# Altium schematic sheet DEBUG.SchDoc
size A3; SheetNumber: 15; SheetTotal: 24
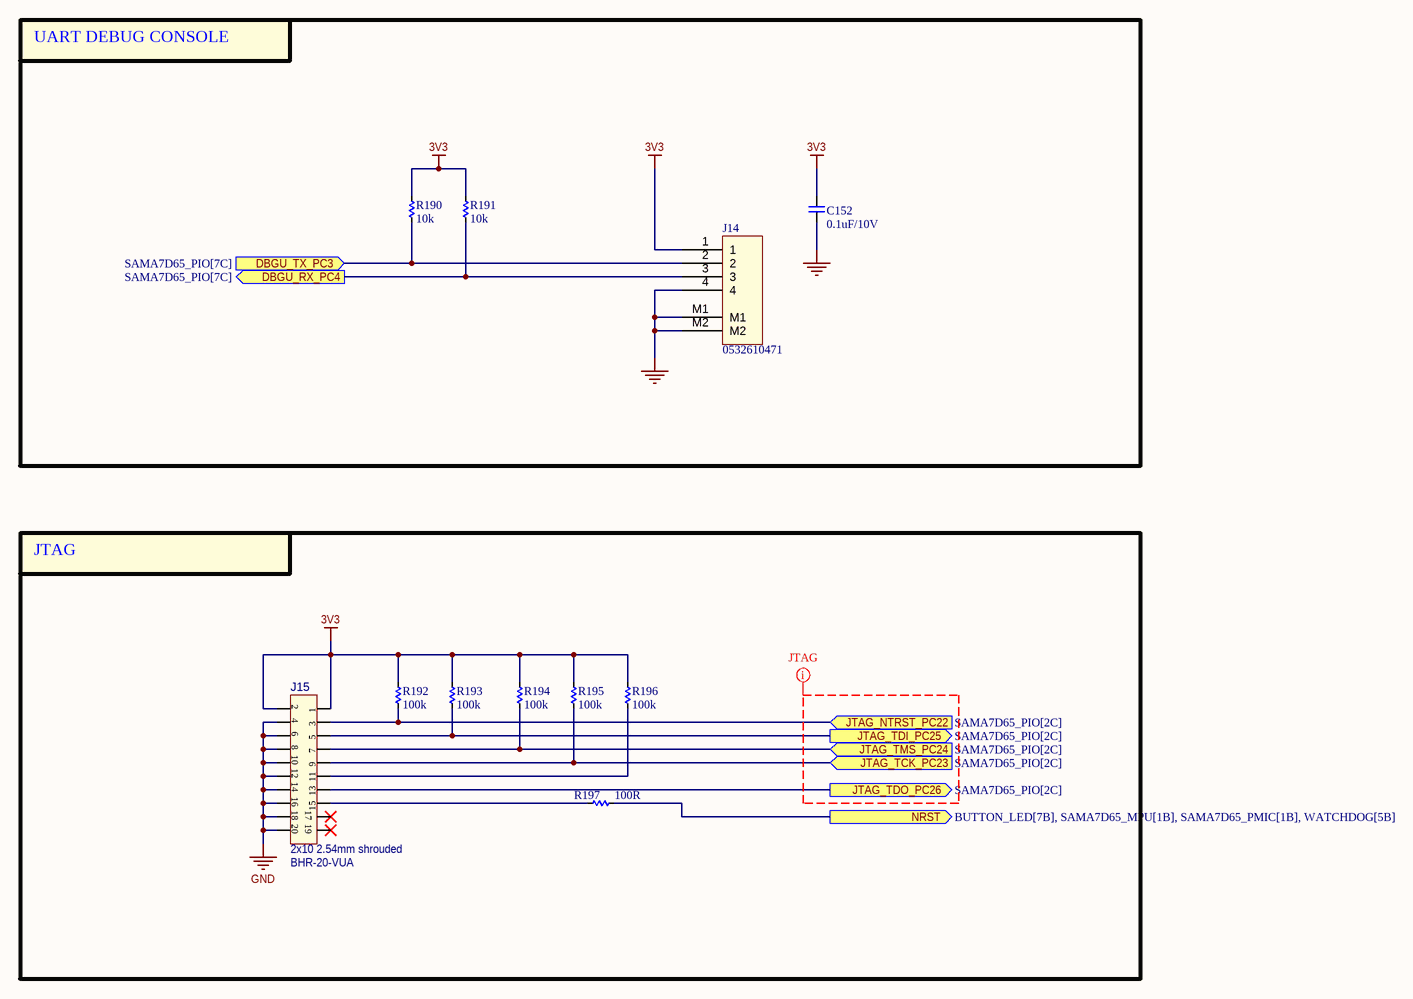
[diagram p0: DEBUG.SchDoc]

## Parts
C152  0.1uF/10V  [CAP_C_1005X50_L]
J14  0532610471  [MOLEX_0532610471]
J15  value 2x10 2.54mm shrouded  Manufacturer Part Number 1: BHR-20-VUA  [HDR_M_2.54_2X10_SBH11-PBPC-D10-ST-BK]  (hidden comment: Header 2x10)
R190  10k  [RES_C_1005x30_L]
R191  10k  [RES_C_1005x30_L]
R192  100k  [RES_C_1005x30_L]
R193  100k  [RES_C_1005x30_L]
R194  100k  [RES_C_1005x30_L]
R195  100k  [RES_C_1005x30_L]
R196  100k  [RES_C_1005x30_L]
R197  100R  [RES_C_1005x30_L]

## Blocks framed on the sheet
UART DEBUG CONSOLE: C152 J14 R190 R191
JTAG: J15 R192-R197

## Ports
DBGU_RX_PC4 (out, see SAMA7D65_PIO[7C]), DBGU_TX_PC3 (in, see SAMA7D65_PIO[7C]), JTAG_NTRST_PC22 (in, see SAMA7D65_PIO[2C]), JTAG_TCK_PC23 (in, see SAMA7D65_PIO[2C]), JTAG_TDI_PC25 (out, see SAMA7D65_PIO[2C]), JTAG_TDO_PC26 (out, see SAMA7D65_PIO[2C]), JTAG_TMS_PC24 (in, see SAMA7D65_PIO[2C]), NRST (out, see BUTTON_LED[7B], SAMA7D65_MPU[1B], SAMA7D65_PMIC[1B], WATCHDOG[5B])

## Nets
3V3: C152.2 J14.1 J15.1 J15.2 R190.1 R191.1 R192.2 R193.2 R194.2 R195.2 R196.2
GND: C152.1 J14.4 J14.M1 J14.M2 J15.4 J15.6 J15.8 J15.10 J15.12 J15.14 J15.16 J15.18 J15.20
DBGU_RX_PC4: J14.3 R191.2 ; port DBGU_RX_PC4
DBGU_TX_PC3: J14.2 R190.2 ; port DBGU_TX_PC3
JTAG_NTRST_PC22: J15.3 R192.1 ; port JTAG_NTRST_PC22
JTAG_TCK_PC23: J15.9 R195.1 ; port JTAG_TCK_PC23
JTAG_TDI_PC25: J15.5 R193.1 ; port JTAG_TDI_PC25
JTAG_TDO_PC26: J15.13 ; port JTAG_TDO_PC26
JTAG_TMS_PC24: J15.7 R194.1 ; port JTAG_TMS_PC24
NRST: R197.2 ; port NRST
NetJ15_11: J15.11 R196.1
NetJ15_15: J15.15 R197.1

Not connected (* = marked no-connect by the designer): J15 17* 19*

## Layout directives
net class JTAG; rule Matched Net Lengths [Tolerance = 2mm]: (no net found under the mark)

## Notes on the sheet
- Project:
- Page Contents:
- Revision:
- Design:
- Date:
- Size:
- A3
- Document Number:
- Sheet:
- of

## Library data of the parts
C152 = _CAP_C_2: CAP CHIP
J14 = Header 4x1_2M
J15 = CON2625: Manufacturer 1: Adam Tech; Description_: CON HDR-2.54 Male 2x10 Gold Shroud 9.1MH TH VERT; Dev Tools Status: Design; Owner: Dragos Danaila; Populated: YES; Voltage: 250VAC; Current: 3A; MCHP-ID: CON2625; Revision: 1; Symbol: Header 2x10; Status: MCL Design; ComponentLink1URL: https://chn-vm-apps.microchip.com/mchprepo/parts/Datasheets/bhr-xx-vua-data-sheet.pdf; ComponentLink1Description: SVN Datasheet; ComponentLink2URL: C:\ALTIUM_WORK\00001_MCHP-CDB\Datasheets\bhr-xx-vua-data-sheet.pdf; ComponentLink2Description: Local Datasheet; ComponentLink3URL: C:\ALTIUM_WORK\00001_MCHP-CDB\Library\LibraryRefs\Header 2x10.SchLib; ComponentLink3Description: Open Symbol; ComponentLink4URL: C:\ALTIUM_WORK\00001_MCHP-CDB\Library\Footprints\HDR_M_2.54_2X10_SBH11-PBPC-D10-ST-BK.PcbLib; ComponentLink4Description: Open Footprint; ComponentLink5Description: Open Footprint 2; ComponentLink6Description: Open Footprint 3; ComponentLink7Description: Open Footprint 4; Type: Header 2.54mm; Category: Connector; Supplier 1: Digi-Key; Supplier Part Number 1: 2057-BHR-20-VUA-ND; Quantity Override: 1; Operating Temperature: -50C to +105C; Assembly Type: TH
R190-R197 = _RES_B_2: RES